# EAGLE design ICM-42688-P_Module (EAGLE 9.6.2)
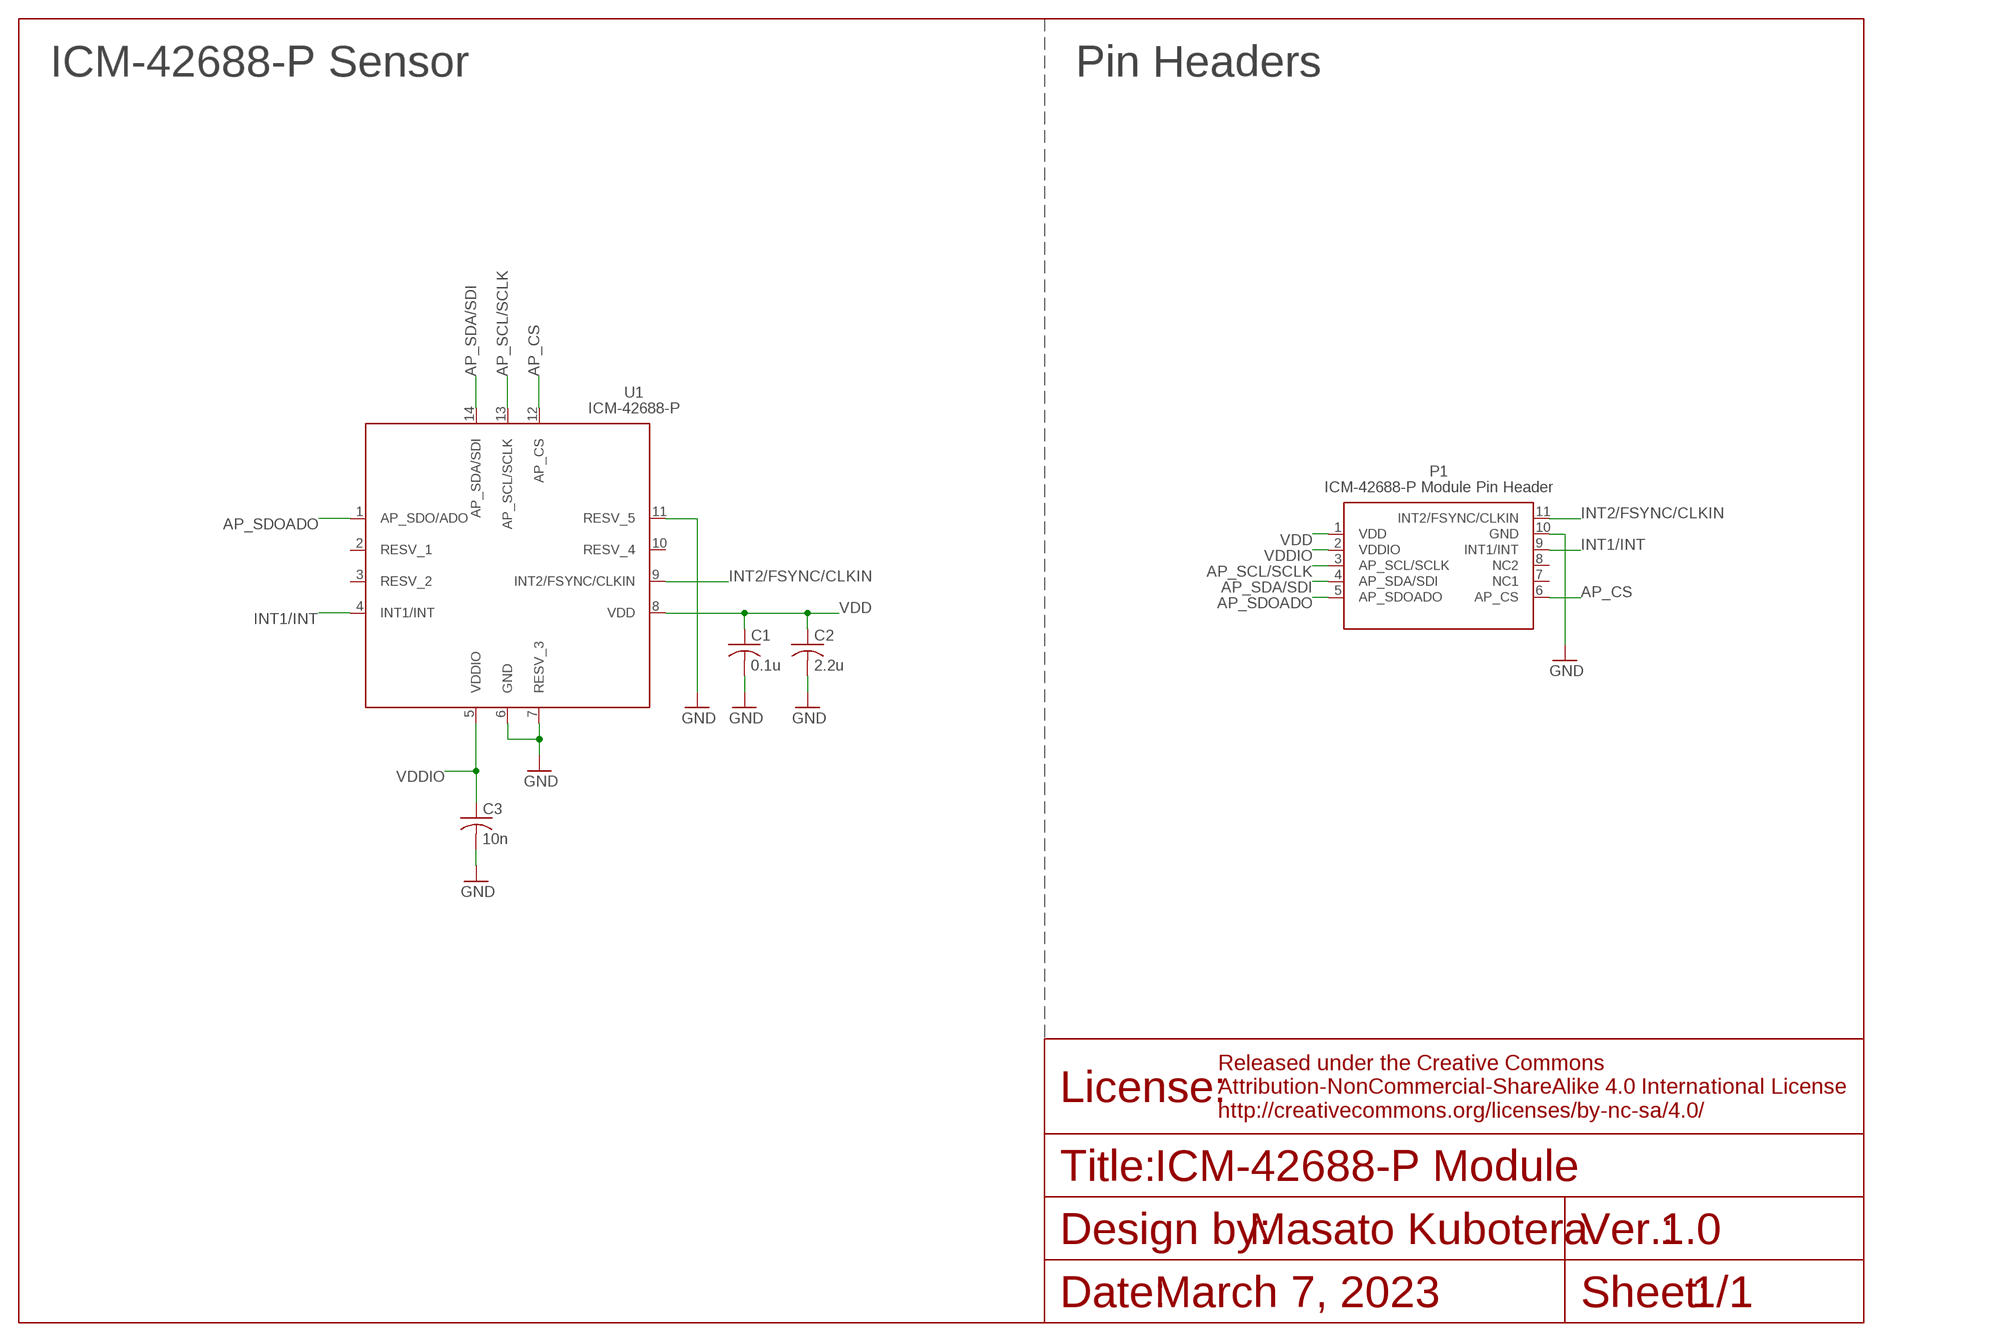
[diagram p0: schematic, sheet 1]

## Parts
C1  0.1u  C-USC0402  [C0402]
C2  2.2u  C-USC0402  [C0402]
C3  10n  C-USC0402  [C0402]
P1  ICM-42688-P-MODULE-PINHEADER  [FOR-MODULE-MAKING]
U1  ICM-42688-P  [ICM-42688-P]

## Nets
AP_CS: P1.6(AP_CS) U1.12(AP_CS)
AP_SCL/SCLK: P1.3(AP_SCL/SCLK) U1.13(AP_SCL/SCLK)
AP_SDA/SDI: P1.4(AP_SDA/SDI) U1.14(AP_SDA/SDI)
AP_SDOADO: P1.5(AP_SDOADO) U1.1(AP_SDO/ADO)
GND: C1.2 C2.2 C3.2 P1.10(GND) U1.6(GND) U1.7(RESV_3) U1.11(RESV_5)
INT1/INT: P1.9(INT1/INT) U1.4(INT1/INT)
INT2/FSYNC/CLKIN: P1.11(INT2/FSYNC/CLKIN) U1.9(INT2/FSYNC/CLKIN)
VDD: C1.1 C2.1 P1.1(VDD) U1.8(VDD)
VDDIO: C3.1 P1.2(VDDIO) U1.5(VDDIO)
Unconnected: P1.7(NC1) P1.8(NC2) U1.2(RESV_1) U1.3(RESV_2) U1.10(RESV_4)

## Notes on the sheet
- ICM-42688-P Sensor | Pin Headers
- ICM-42688-P Module
- 1.0
- March 7, 2023 | 1/1

## Library data of the parts
C1-C3 = rcl:C-US: CAPACITOR, American symbol; SPICEPREFIX: C
P1 = ICM-42688-P-Module:ICM-42688-P-MODULE-PINHEADER
U1 = ICM-42688-P:ICM-42688-P

## Net classes
0 default: width 0.203 mm, drill 0.3 mm, clearance 0.203 mm

## Board
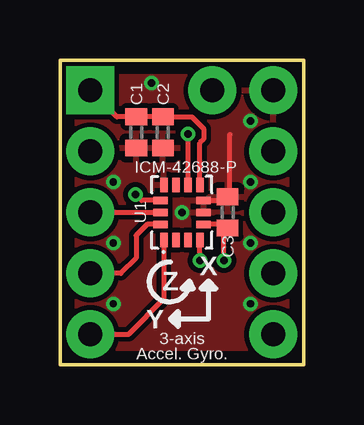
[diagram p1: board, top side]
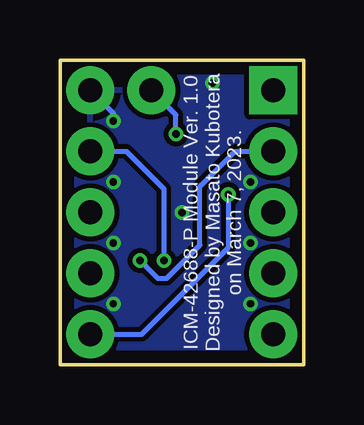
[diagram p2: board, bottom side, seen from below]

Size 10.16 x 12.7 mm. Coordinates in mm from the lower left corner, seen from the top.
Outline: 0,12.7 0,0 10.16,0 10.16,12.7 0,12.7
Copper layers (1*16): Top 0.035mm / dielectric 1.6mm / Bottom 0.035mm
Design rules "Elecrow_2-layer_PCB_eagle_rule": minimum track width 6mil, minimum drill 12mil, track to track 6mil, track to pad 6mil, pad to pad 6mil, via to via 8mil, smd to smd 0mil, copper to edge 20mil, drill to drill 10mil, minimum pad ring 6mil, minimum via ring 6mil, stop-mask expansion 0mil, vias tented up to drill 100mil, thermal gap 10mil

### Footprints (pad centres in the part's own frame; a part is rotated, then mirrored left to right if it is on the bottom)
C0402 = smd 0.7 x 0.9: 1 -0.65,0; 2 0.65,0
FOR-MODULE-MAKING = drill 1 pad 2 square: 1 -3.81,5.08 | drill 1 pad 2: 2 -3.81,2.54; 3 -3.81,0; 4 -3.81,-2.54; 5 -3.81,-5.08; 6 3.81,-5.08; 7 3.81,-2.54; 8 3.81,0; 9 3.81,2.54; 10 3.81,5.08; 11 1.27,5.08
ICM-42688-P = smd 0.6 x 0.3: 1 -1.15,0.75; 2 -1.15,0.25; 3 -1.15,-0.25; 4 -1.15,-0.75; 8 1.15,-0.75; 9 1.15,-0.25; 10 1.15,0.25; 11 1.15,0.75 | smd 0.3 x 0.6: 5 -0.5,-0.9; 6 0,-0.9; 7 0.5,-0.9; 12 0.5,0.9; 13 0,0.9; 14 -0.5,0.9

### Placement (x,y rotation side)
C1  3.17,9.68 270 top
C2  4.29,9.68 270 top
C3  6.99,6.35 90 top
P1  5.08,6.35 0 top
U1  5.08,6.35 90 top

### Tracks (layer width: path | path; a pad name or v marks a point on that pad's centre or on a via)
AP_CS  (via drill 0.3)
  Top 0.203: U1.12 3.4,6.85 v3.15,7.1
  Bottom 0.203: P1.6 6.75,1.27 3.15,4.88 v3.15,7.1
AP_SCL/SCLK
  Top 0.203: P1.3 U1.13
AP_SDA/SDI
  Top 0.203: U1.14 3.63,5.85 3.17,5.4 3.17,4.44 2.54,3.81 P1.4
AP_SDOADO
  Top 0.203: U1.1 4.33,2.74 2.86,1.27 P1.5
GND  (via drill 0.3)
  Top 0.203: 7.08,9.6 7.08,7.1 C3.2 6.99,6.85 U1.7
  Bottom 0.203: P1.10 7.94,10.48 v7.94,10.16
  other vias: 7.94,2.54 7.94,5.08 2.22,2.54 2.22,5.08 7.94,7.62 2.22,7.62 3.81,11.75 5.08,6.35
  pour Top: -0.63,13.34 -0.63,-0.64 10.79,-0.64 10.79,13.34
  pour Bottom: -1.27,13.97 -1.27,-1.27 11.43,-1.27 11.43,13.97
INT1/INT  (via drill 0.3)
  Top 0.203: v5.83,4.35 U1.4
  Bottom 0.203: P1.9 7.39,8.89 5.83,7.33 v5.83,4.35
INT2/FSYNC/CLKIN  (via drill 0.3)
  Top 0.203: v5.33,9.62 U1.9
  Bottom 0.203: v5.33,9.62 5.33,10.41 P1.11
VDD
  Top 0.203: U1.8 5.83,9.25 5.99,9.4 5.99,9.84 5.5,10.33 C2.1 C1.1 2.37,10.33 P1.1
VDDIO  (via drill 0.3)
  Top 0.203: U1.5 6.83,5.85 C3.1 6.83,5.6 v6.83,4.35
  Bottom 0.203: v6.83,4.35 6.08,3.6 5.71,3.6 4.33,4.98 4.33,7.41 2.85,8.89 P1.2

### Text on the board
tPlace: ICM-42688-P | 3-axis | Accel. Gyro.
bPlace: ICM-42688-P Module Ver. 1.0 / Designed by Masato Kubotera / on March 7, 2023.
tNames: X | Z | Y